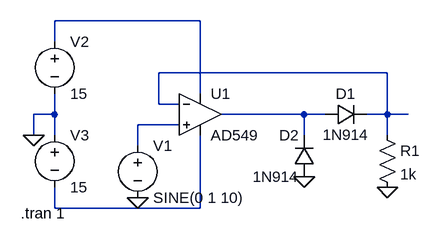
[diagram p0: schematic IdealOpamp.asc]
IdealOpamp.asc, the LTspice schematic file:
Version 4
SHEET 1 880 680
WIRE 144 16 -80 16
WIRE -80 48 -80 16
WIRE 432 96 80 96
WIRE 144 128 144 16
WIRE 80 144 80 96
WIRE 112 144 80 144
WIRE -80 160 -80 128
WIRE -80 160 -112 160
WIRE 304 160 176 160
WIRE 336 160 304 160
WIRE 432 160 432 96
WIRE 432 160 400 160
WIRE 464 160 432 160
WIRE 112 176 48 176
WIRE -112 192 -112 160
WIRE -80 192 -80 160
WIRE 304 192 304 160
WIRE 432 192 432 160
WIRE 48 208 48 176
WIRE -80 304 -80 272
WIRE 144 304 144 192
WIRE 144 304 -80 304
FLAG 432 272 0
FLAG 304 256 0
FLAG 48 288 0
FLAG -112 192 0
SYMBOL Opamps\\AD549 144 96 R0
SYMATTR InstName U1
SYMBOL diode 336 176 R270
WINDOW 0 32 32 VTop 2
WINDOW 3 0 32 VBottom 2
SYMATTR InstName D1
SYMATTR Value 1N914
SYMBOL diode 320 256 R180
WINDOW 0 24 64 Left 2
WINDOW 3 24 0 Left 2
SYMATTR InstName D2
SYMATTR Value 1N914
SYMBOL res 416 176 R0
SYMATTR InstName R1
SYMATTR Value 1k
SYMBOL voltage 48 192 R0
WINDOW 123 0 0 Left 0
WINDOW 39 0 0 Left 0
SYMATTR InstName V1
SYMATTR Value SINE(0 1 10)
SYMBOL voltage -80 32 R0
WINDOW 123 0 0 Left 0
WINDOW 39 0 0 Left 0
SYMATTR InstName V2
SYMATTR Value 15
SYMBOL voltage -80 176 R0
WINDOW 123 0 0 Left 0
WINDOW 39 0 0 Left 0
SYMATTR InstName V3
SYMATTR Value 15
TEXT -132 312 Left 2 !.tran 1

The netlist it stands for:
* IdealOpamp.asc
XU1 N004 N002 N001 N005 N003 AD549  ; pins In+ In- V+ V- OUT
D1 N003 N002 1N914
D2 0 N003 1N914
R1 N002 0 1k
V1 N004 0 SINE(0 1 10)
V2 N001 0 15
V3 0 N005 15
.model D D
.lib standard.dio
.tran 1
.backanno
.end